# Altium project Bluetooth_Sentinel.PrjPcb
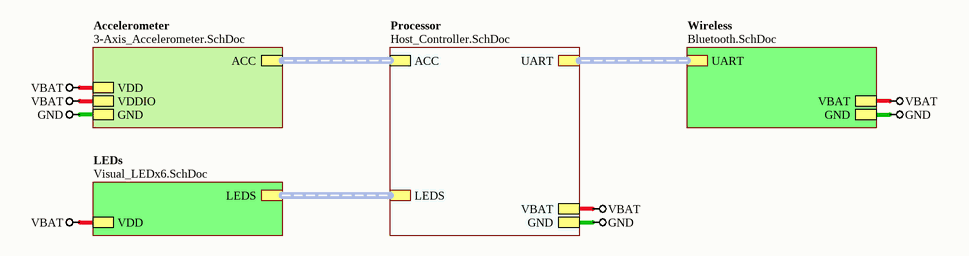
[diagram p0: Bluetooth_Sentinel.SchDoc]
3 sheets, 6 parts. Net scope: hierarchical (ports join the sheet entries above them; power ports are global).
Board file: Bluetooth_Sentinel.PcbDoc
Sheets:
  Bluetooth_Sentinel.SchDoc
    Processor = Host_Controller.SchDoc
      Microcontroller_STM32F101 = Microcontroller_STM32F101.SchDoc

## Sheet Bluetooth_Sentinel.SchDoc: Bluetooth Sentinel
size A4

### Sub-sheets
Accelerometer = 3-Axis_Accelerometer.SchDoc (file not in this document): VDD, VDDIO, GND, ACC (harness SPI_LIS331)
LEDs = Visual_LEDx6.SchDoc (file not in this document): VDD, LEDS (harness LEDx6)
Processor = Host_Controller.SchDoc: UART (harness UART_HS), LEDS (harness LEDx6), VBAT, GND, ACC (harness SPI_LIS331)
Wireless = Bluetooth.SchDoc (file not in this document): UART (harness UART_HS), VBAT, GND

### Nets
GND: sheet Wireless/GND, sheet Processor/GND, sheet Accelerometer/GND
VBAT: sheet LEDs/VDD, sheet Wireless/VBAT, sheet Processor/VBAT, sheet Accelerometer/VDD, sheet Accelerometer/VDDIO

### Buses and harness runs
harness sheet Accelerometer/ACC = sheet Processor/ACC
harness sheet LEDs/LEDS = sheet Processor/LEDS
harness sheet Processor/UART = sheet Wireless/UART

### Notes on the sheet
- Sheet Title
- Project Title
- Size:
- Date:
- A4
- Item:
- Time:
- Revision:
- Sheet
- of
- File:

## Sheet Host_Controller.SchDoc: Host Controller
size A4
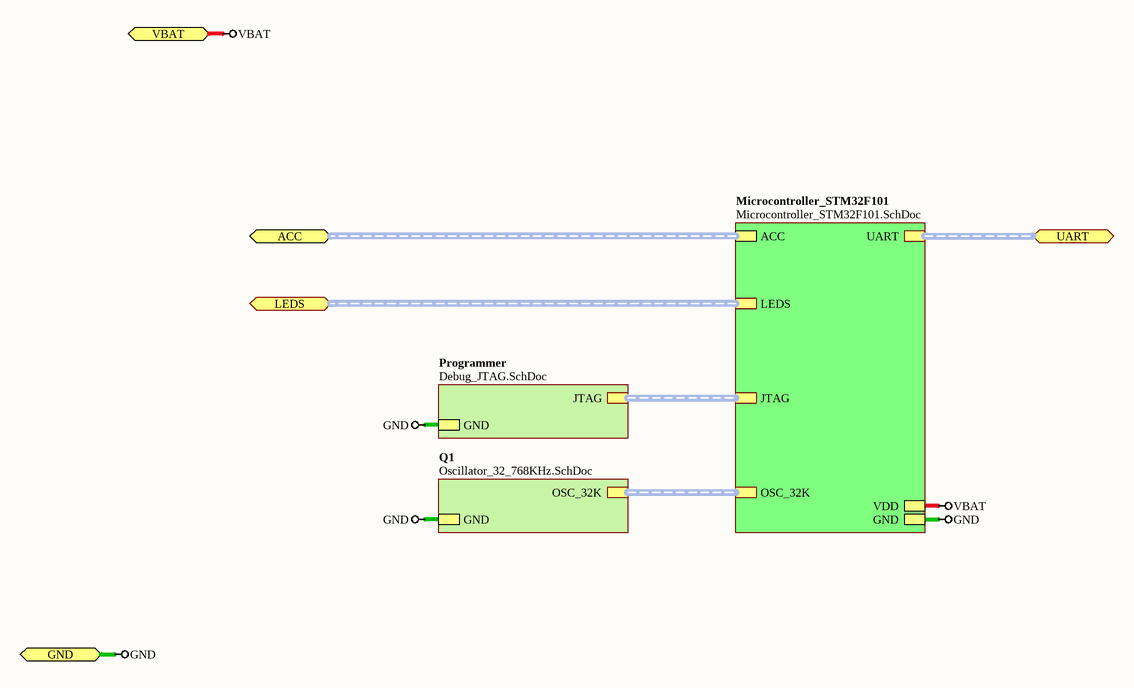
[diagram p1: Host_Controller.SchDoc]

### Sub-sheets
Microcontroller_STM32F101 = Microcontroller_STM32F101.SchDoc: JTAG (harness JTAG), GND, VDD, UART (harness UART_HS), OSC_32K (harness OSC), LEDS (harness LEDx6), ACC (harness SPI_LIS331)
Programmer = Debug_JTAG.SchDoc (file not in this document): JTAG (harness JTAG), GND
Q1 = Oscillator_32_768KHz.SchDoc (file not in this document): GND, OSC_32K (harness OSC)

### Ports
ACC (harness SPI_LIS331), GND, LEDS (harness LEDx6), UART (harness UART_HS), VBAT

### Nets
GND: port GND, sheet Programmer/GND, sheet Microcontroller_STM32F101/GND, sheet Q1/GND
VBAT: port VBAT, sheet Microcontroller_STM32F101/VDD

### Buses and harness runs
harness port ACC = sheet Microcontroller_STM32F101/ACC
harness port LEDS = sheet Microcontroller_STM32F101/LEDS
harness port UART = sheet Microcontroller_STM32F101/UART
harness sheet Microcontroller_STM32F101/JTAG = sheet Programmer/JTAG
harness sheet Microcontroller_STM32F101/OSC_32K = sheet Q1/OSC_32K

### Notes on the sheet
- Sheet Title
- Project Title
- Size:
- Date:
- A4
- Item:
- Time:
- Revision:
- Sheet
- of
- File:

## Sheet Microcontroller_STM32F101.SchDoc: Microcontroller STM32F101
size A4
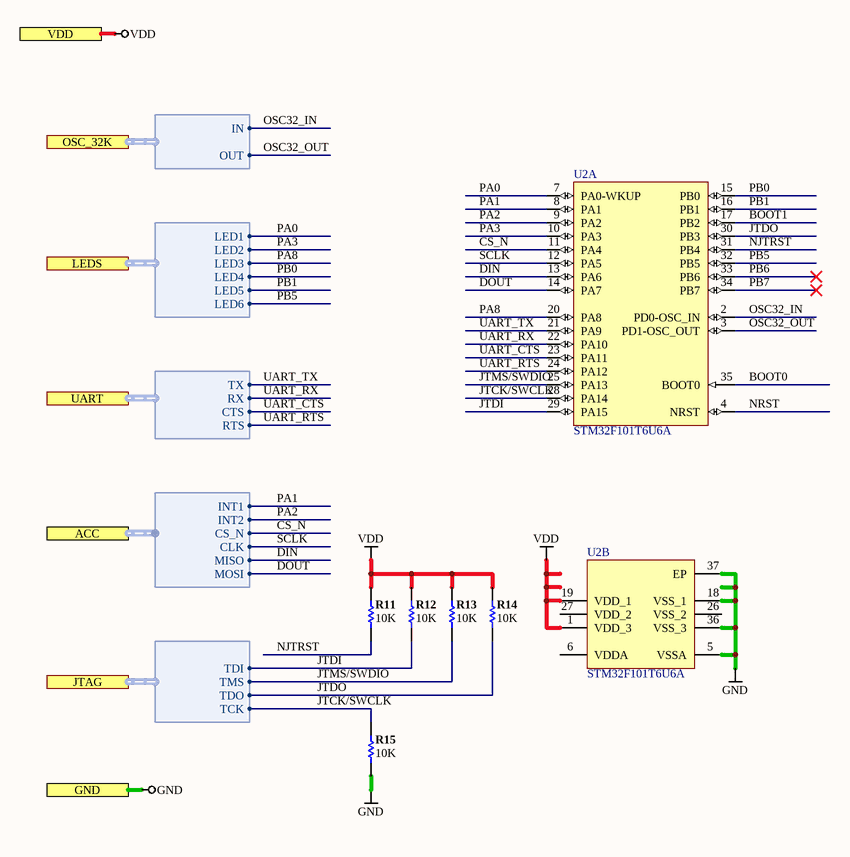
[diagram p2: Microcontroller_STM32F101.SchDoc]

### Parts
R11  value 10K  [RESC0402(1005)_N]  (hidden comment: 10K 5% 0402(1005))
R12  value 10K  [RESC0402(1005)_N]  (hidden comment: 10K 5% 0402(1005))
R13  value 10K  [RESC0402(1005)_N]  (hidden comment: 10K 5% 0402(1005))
R14  value 10K  [RESC0402(1005)_N]  (hidden comment: 10K 5% 0402(1005))
R15  value 10K  [RESC0402(1005)_N]  (hidden comment: 10K 5% 0402(1005))
U2  STM32F101T6U6A  [STM-VFQFPN36_N]  (parts A,B of 2)

### Ports
ACC (harness SPI_LIS331), GND, JTAG (harness JTAG), LEDS (harness LEDx6), OSC_32K (harness OSC), UART (harness UART_HS), VDD

### Harnesses
JTAG: TMS, TCK, TDI, TDO
UART_HS: RX, RTS, TX, CTS
OSC: OUT, IN
LEDx6: LED1, LED2, LED3, LED4, LED5, LED6
SPI_LIS331: CLK, CS_N, MOSI, MISO, INT1, INT2

### Nets
GND: R15.1 U2.5(VSSA) U2.18(VSS_1) U2.36(VSS_3) U2.37(EP) ; port GND
VDD: R11.2 R12.2 R13.2 R14.2 U2.1(VDD_3) U2.19(VDD_1) ; port VDD  [project net VBAT]
BOOT0: U2.35(BOOT0)
BOOT1: U2.17(PB2)
CS_N: U2.11(PA4) ; port ACC.CS_N
DIN: U2.13(PA6) ; port ACC.MISO
DOUT: U2.14(PA7) ; port ACC.MOSI
JTCK/SWCLK: R15.2 U2.28(PA14) ; port JTAG.TCK
JTDI: R12.1 U2.29(PA15) ; port JTAG.TDI
JTDO: R14.1 U2.30(PB3) ; port JTAG.TDO
JTMS/SWDIO: R13.1 U2.25(PA13) ; port JTAG.TMS
NJTRST: R11.1 U2.31(PB4)
NRST: U2.4(NRST)
OSC32_IN: U2.2(PD0-OSC_IN) ; port OSC_32K.IN
OSC32_OUT: U2.3(PD1-OSC_OUT) ; port OSC_32K.OUT
PA0: U2.7(PA0-WKUP) ; port LEDS.LED1
PA1: U2.8(PA1) ; port ACC.INT1
PA2: U2.9(PA2) ; port ACC.INT2
PA3: U2.10(PA3) ; port LEDS.LED2
PA8: U2.20(PA8) ; port LEDS.LED3
PB0: U2.15(PB0) ; port LEDS.LED4
PB1: U2.16(PB1) ; port LEDS.LED5
PB5: U2.32(PB5) ; port LEDS.LED6
PB6: U2.33(PB6)
PB7: U2.34(PB7)
SCLK: U2.12(PA5) ; port ACC.CLK
UART_CTS: U2.23(PA11) ; port UART.CTS
UART_RTS: U2.24(PA12) ; port UART.RTS
UART_RX: U2.22(PA10) ; port UART.RX
UART_TX: U2.21(PA9) ; port UART.TX

Not connected (* = marked no-connect by the designer): U2 6(VDDA) 26(VSS_2) 27(VDD_2)

### Notes on the sheet
- Sheet Title
- Project Title
- Size:
- Date:
- A4
- Item:
- Time:
- Revision:
- Sheet
- of
- File:

### Library data of the parts
R11-R15 = CMP-1011-00098-1: 10K 0.063W 5% 0402 (1005 Metric)  SMD; Case-Metric: 1005; Case-EIA: 0402; Technology: SMT; Tolerance: 5 %; Power: 0.063 W
U2 = CMP-0237-00044-3: ARM Cortex-M3 32-bit MCU, 32 KB Flash, 6 KB Internal RAM, 26 I/Os, 36-pin VFQFPN, -40 to 85 degC, Tray; A/D Converter: 1x12-bit (10 Channel); FLASH Size (Prog) (kB): 32; I/Os (High Current): 26; Internal RAM Size (kB): 6; Operating Frequency(F) (Processor speed) (MHz): 36; Supply Voltage(Vcc) min (V): 2; ComponentLink1URL: http://www.st.com/web/en/home.html; ComponentLink1Description: Manufacturer URL; PackageDescription: 36-Pin Quad Flat No-Lead, 6 x 6 x 1.0 mm Body, 0.5 mm Pitch, Exposed Pad; ComponentLink2Description: Datasheet; ComponentLink3Description: Package Specification; PackageReference: VFQFPN36; ComponentLink2URL: http://www.st.com/st-web-ui/static/active/en/resource/technical/document/datasheet/CD00210837.pdf; DatasheetVersion: Rev. 5; PackageVersion: Rev. 16, 08/2013; ComponentLink3URL: http://www.st.com/st-web-ui/static/active/en/resource/technical/document/datasheet/CD00161561.pdf; Core: ARM Cortex-M3; Mounting Technology: Surface Mount; Packing: Tray; PartNumber: STM32F101T6U6A